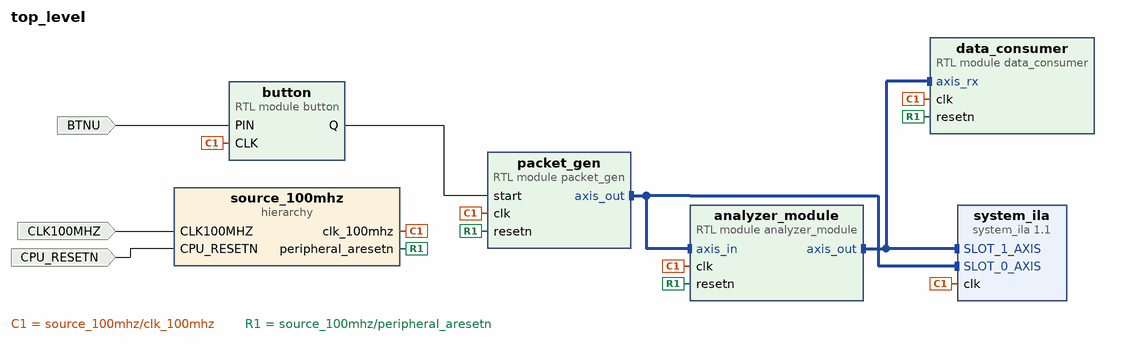
[diagram p0: block diagram of the top level]
# Vivado block design top_level, xc7a100tcsg324-1, Vivado 2021.1.1
create_bd_design top_level

create_bd_port -dir I -type clk CLK100MHZ
create_bd_port -dir I -type rst CPU_RESETN
create_bd_port -dir I BTNU

create_bd_cell -type module -reference button button
create_bd_cell -type hier source_100mhz
create_bd_cell -type module -reference packet_gen packet_gen
create_bd_cell -type module -reference data_consumer data_consumer
create_bd_cell -type ip -vlnv xilinx.com:ip:system_ila:1.1 system_ila
set_property -dict [list \
  CONFIG.C_NUM_MONITOR_SLOTS 2 \
  CONFIG.C_SLOT 1 \
  CONFIG.C_SLOT_0_INTF_TYPE xilinx.com:interface:axis_rtl:1.0 \
  CONFIG.C_SLOT_1_INTF_TYPE xilinx.com:interface:axis_rtl:1.0 \
] [get_bd_cells system_ila]
create_bd_cell -type module -reference analyzer_module analyzer_module

# ---- hierarchy /source_100mhz ----
current_bd_instance /source_100mhz
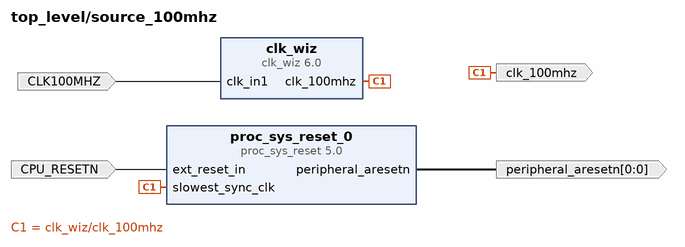
[diagram p1: block diagram inside /source_100mhz]
create_bd_pin -dir O -type clk clk_100mhz
create_bd_pin -dir I -type rst CPU_RESETN
create_bd_pin -dir I -type clk CLK100MHZ
create_bd_pin -dir O -from 0 -to 0 -type rst peripheral_aresetn

create_bd_cell -type ip -vlnv xilinx.com:ip:proc_sys_reset:5.0 proc_sys_reset_0
create_bd_cell -type ip -vlnv xilinx.com:ip:clk_wiz:6.0 clk_wiz
set_property -dict {CONFIG.CLK_OUT1_PORT clk_100mhz CONFIG.USE_LOCKED false CONFIG.USE_RESET false} [get_bd_cells clk_wiz]

# ---- connections ----

current_bd_instance /source_100mhz
connect_bd_net -net clk_in1_0_1 [get_bd_pins CLK100MHZ] [get_bd_pins clk_wiz/clk_in1]
connect_bd_net [get_bd_pins clk_wiz/clk_100mhz] [get_bd_pins clk_100mhz] [get_bd_pins proc_sys_reset_0/slowest_sync_clk]
connect_bd_net -net ext_reset_in_0_1 [get_bd_pins CPU_RESETN] [get_bd_pins proc_sys_reset_0/ext_reset_in]
connect_bd_net [get_bd_pins proc_sys_reset_0/peripheral_aresetn] [get_bd_pins peripheral_aresetn]

current_bd_instance /
connect_bd_intf_net -intf_net packet_analyzer_0_axis_out [get_bd_intf_pins analyzer_module/axis_in] [get_bd_intf_pins packet_gen/axis_out]
connect_bd_intf_net [get_bd_intf_pins analyzer_module/axis_in] [get_bd_intf_pins system_ila/SLOT_0_AXIS]
connect_bd_intf_net -intf_net packet_analyzer_0_axis_out1 [get_bd_intf_pins analyzer_module/axis_out] [get_bd_intf_pins data_consumer/axis_rx]
connect_bd_intf_net [get_bd_intf_pins analyzer_module/axis_out] [get_bd_intf_pins system_ila/SLOT_1_AXIS]
connect_bd_net -net PIN_0_1 [get_bd_ports BTNU] [get_bd_pins button/PIN]
connect_bd_net -net button_0_Q [get_bd_pins button/Q] [get_bd_pins packet_gen/start]
connect_bd_net -net clk_in1_0_1 [get_bd_ports CLK100MHZ] [get_bd_pins source_100mhz/CLK100MHZ]
connect_bd_net -net clk_wiz_clk_100mhz [get_bd_pins source_100mhz/clk_100mhz] \
  [get_bd_pins button/CLK] [get_bd_pins packet_gen/clk] [get_bd_pins data_consumer/clk] [get_bd_pins system_ila/clk] \
  [get_bd_pins analyzer_module/clk]
connect_bd_net -net ext_reset_in_0_1 [get_bd_ports CPU_RESETN] [get_bd_pins source_100mhz/CPU_RESETN]
connect_bd_net [get_bd_pins source_100mhz/peripheral_aresetn] \
  [get_bd_pins packet_gen/resetn] [get_bd_pins data_consumer/resetn] [get_bd_pins analyzer_module/resetn]

validate_bd_design
save_bd_design
